# EasyEDA schematic SCH_4Mb OMEGA V2 LEDS copy_2023-09-07.json
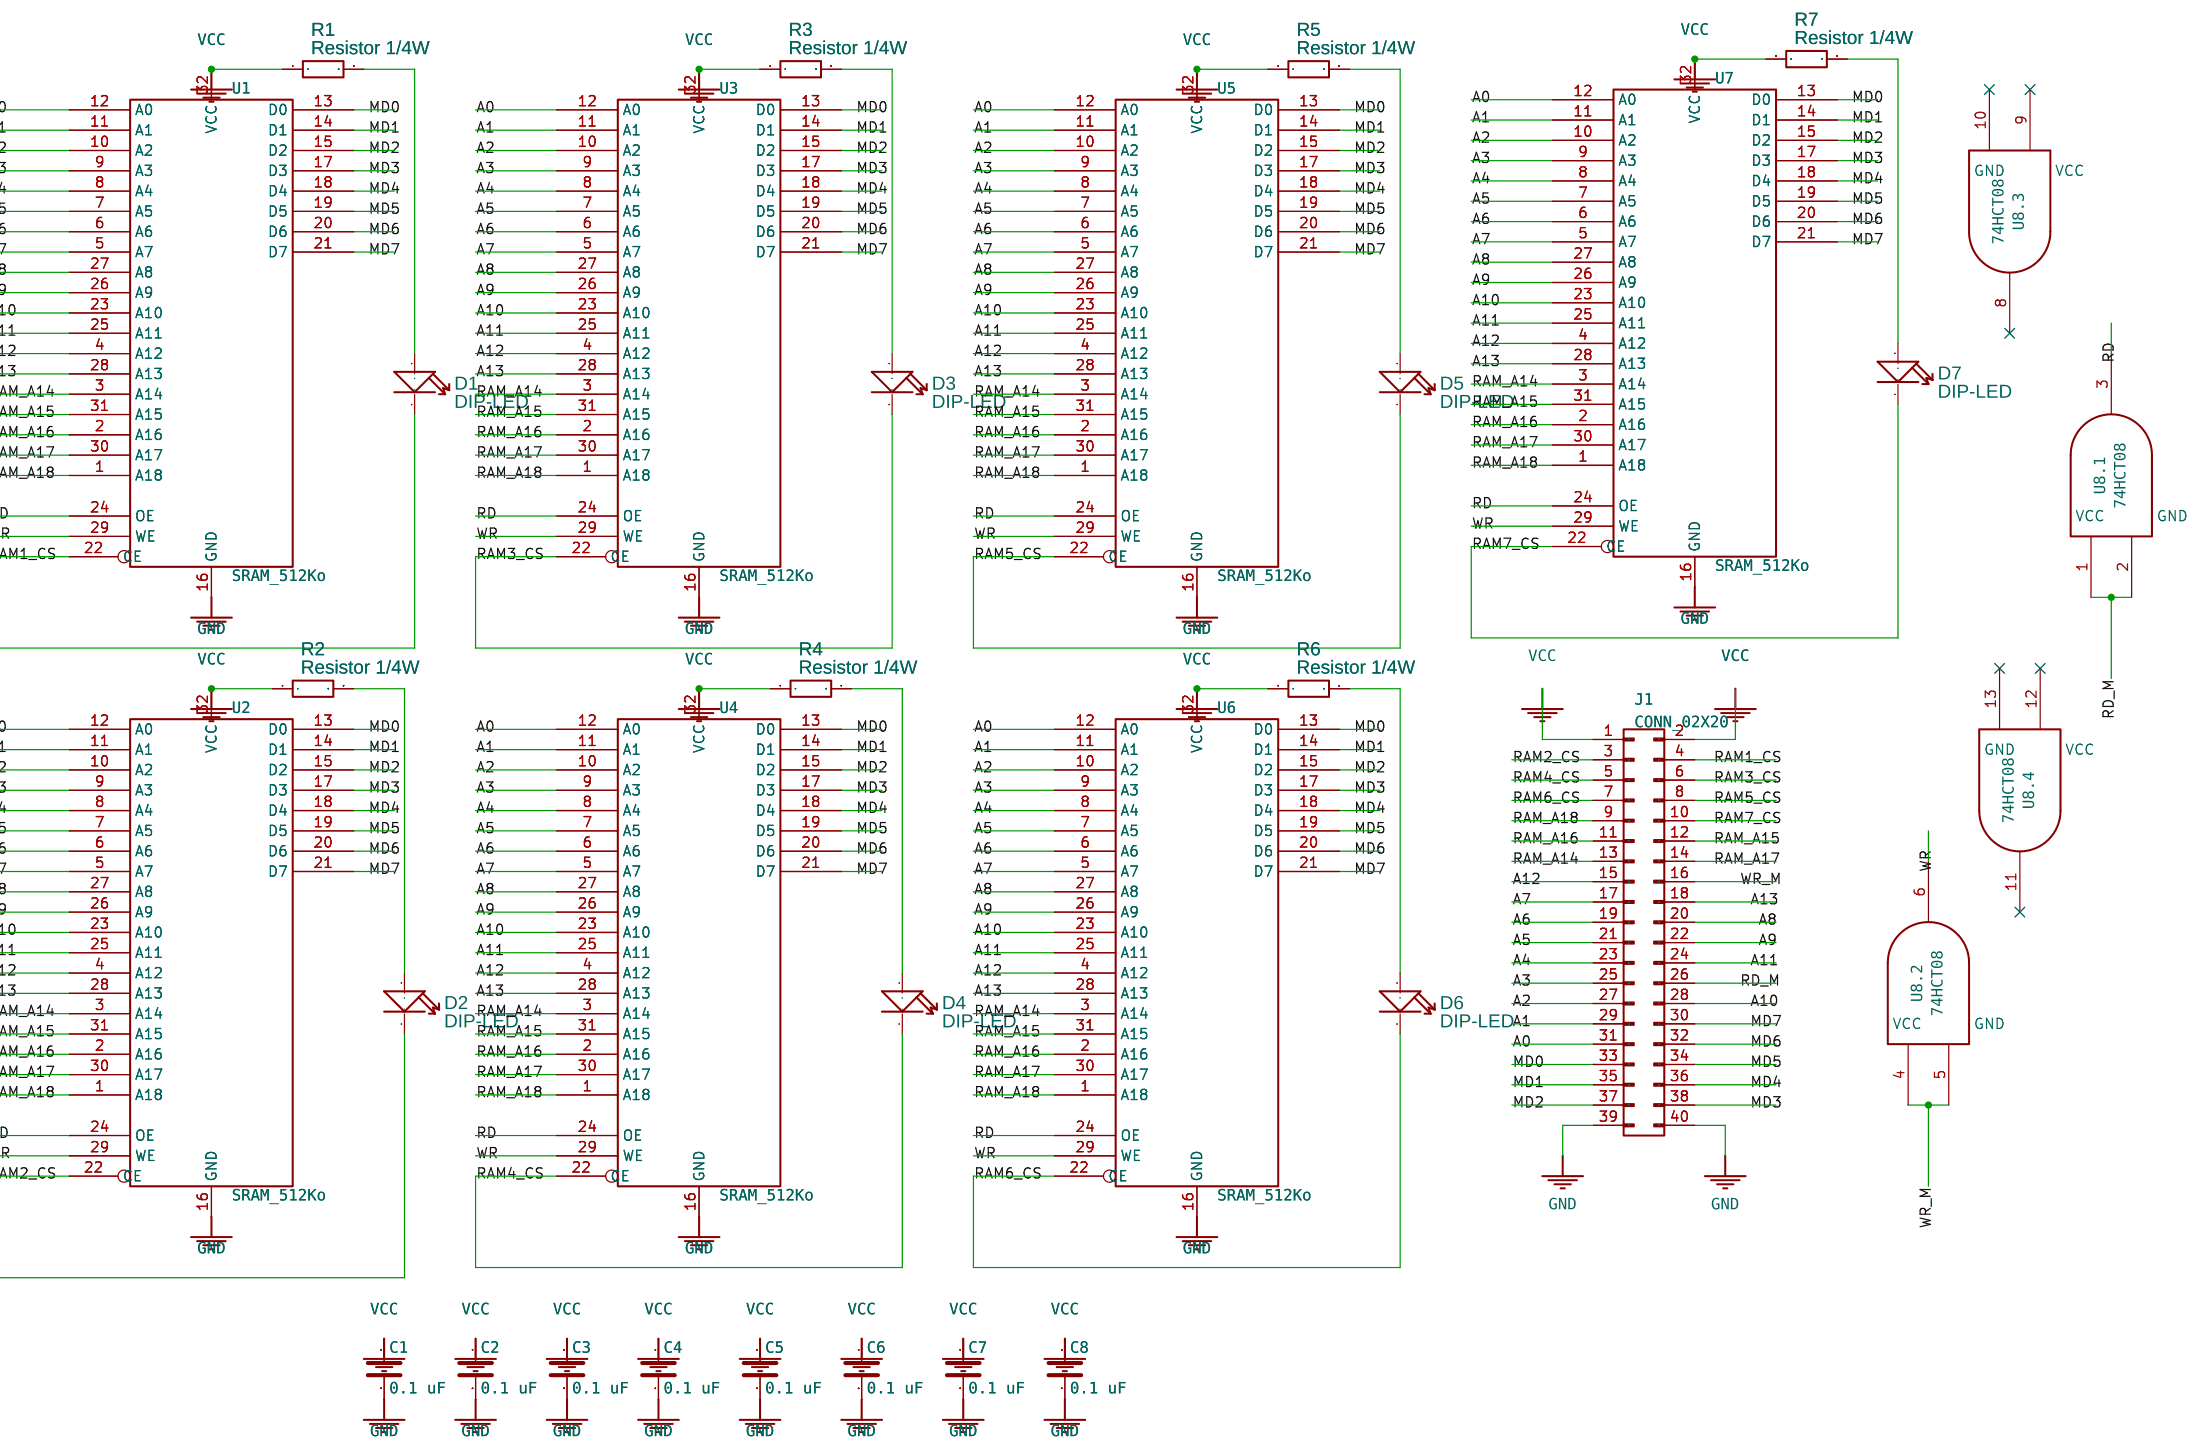
[diagram p0: schematic sheet]

## Parts
C1  0.1 uF  [C_DISC_D7.5MM_W2.5MM_P5.00MM]
C2  0.1 uF  [C_DISC_D7.5MM_W2.5MM_P5.00MM]
C3  0.1 uF  [C_DISC_D7.5MM_W2.5MM_P5.00MM]
C4  0.1 uF  [C_DISC_D7.5MM_W2.5MM_P5.00MM]
C5  0.1 uF  [C_DISC_D7.5MM_W2.5MM_P5.00MM]
C6  0.1 uF  [C_DISC_D7.5MM_W2.5MM_P5.00MM]
C7  0.1 uF  [C_DISC_D7.5MM_W2.5MM_P5.00MM]
C8  0.1 uF  [C_DISC_D7.5MM_W2.5MM_P5.00MM]
D1  DIP-LED  [LED2-2.54-D3.0MM]
D2  DIP-LED  [LED2-2.54-D3.0MM]
D3  DIP-LED  [LED2-2.54-D3.0MM]
D4  DIP-LED  [LED2-2.54-D3.0MM]
D5  DIP-LED  [LED2-2.54-D3.0MM]
D6  DIP-LED  [LED2-2.54-D3.0MM]
D7  DIP-LED  [LED2-2.54-D3.0MM]
J1  CONN_02X20  [SOCKET_STRIP_STRAIGHT_2X20_PITCH2.54MM]
R1  Resistor 1/4W  [RESISTOR 1/4W]
R2  Resistor 1/4W  [RESISTOR 1/4W]
R3  Resistor 1/4W  [RESISTOR 1/4W]
R4  Resistor 1/4W  [RESISTOR 1/4W]
R5  Resistor 1/4W  [RESISTOR 1/4W]
R6  Resistor 1/4W  [RESISTOR 1/4W]
R7  Resistor 1/4W  [RESISTOR 1/4W]
U1  SRAM_512Ko  [DIP-32_W15.24MM_LONGPADS_ORIFICIO_0_95]
U2  SRAM_512Ko  [DIP-32_W15.24MM_LONGPADS_ORIFICIO_0_95]
U3  SRAM_512Ko  [DIP-32_W15.24MM_LONGPADS_ORIFICIO_0_95]
U4  SRAM_512Ko  [DIP-32_W15.24MM_LONGPADS_ORIFICIO_0_95]
U5  SRAM_512Ko  [DIP-32_W15.24MM_LONGPADS_ORIFICIO_0_95]
U6  SRAM_512Ko  [DIP-32_W15.24MM_LONGPADS_ORIFICIO_0_95]
U7  SRAM_512Ko  [DIP-32_W15.24MM_LONGPADS_ORIFICIO_0_95]
U8  74HCT08  [DIP-14_ORIFICIO_0_95]  (sections 1,2,3,4)

## Library data of the parts
D1-D7 = DIP-LED-GREEN-GREEN(2P-D3MM): Contributor: Mudassir_Ahmed_Khan
R1-R7 = Resistor 1/4W: Power: 1/4W; Tolerance: ±1%; Supplier Part: C57435; Supplier: LCSC; Manufacturer: UniOhm; Manufacturer Part: MFR0W4F1001A50; Contributor: hafiz_8030

## Nets
GND: C1.2 C2.2 C3.2 C4.2 C5.2 C6.2 C7.2 C8.2 J1.39(P39) J1.40(P40) U1.16(GND) U2.16(GND) U3.16(GND) U4.16(GND) U5.16(GND) U6.16(GND) U7.16(GND)
VCC: C1.1 C2.1 C3.1 C4.1 C5.1 C6.1 C7.1 C8.1 J1.1(P1) J1.2(P2) R1.1 R2.1 R3.1 R4.1 R5.1 R6.1 R7.1 U1.32(VCC) U2.32(VCC) U3.32(VCC) U4.32(VCC) U5.32(VCC) U6.32(VCC) U7.32(VCC)
A0: J1.31(P31) U1.12(A0) U2.12(A0) U3.12(A0) U4.12(A0) U5.12(A0) U6.12(A0) U7.12(A0)
A1: J1.29(P29) U1.11(A1) U2.11(A1) U3.11(A1) U4.11(A1) U5.11(A1) U6.11(A1) U7.11(A1)
A2: J1.27(P27) U1.10(A2) U2.10(A2) U3.10(A2) U4.10(A2) U5.10(A2) U6.10(A2) U7.10(A2)
A3: J1.25(P25) U1.9(A3) U2.9(A3) U3.9(A3) U4.9(A3) U5.9(A3) U6.9(A3) U7.9(A3)
A4: J1.23(P23) U1.8(A4) U2.8(A4) U3.8(A4) U4.8(A4) U5.8(A4) U6.8(A4) U7.8(A4)
A5: J1.21(P21) U1.7(A5) U2.7(A5) U3.7(A5) U4.7(A5) U5.7(A5) U6.7(A5) U7.7(A5)
A6: J1.19(P19) U1.6(A6) U2.6(A6) U3.6(A6) U4.6(A6) U5.6(A6) U6.6(A6) U7.6(A6)
A7: J1.17(P17) U1.5(A7) U2.5(A7) U3.5(A7) U4.5(A7) U5.5(A7) U6.5(A7) U7.5(A7)
A8: J1.20(P20) U1.27(A8) U2.27(A8) U3.27(A8) U4.27(A8) U5.27(A8) U6.27(A8) U7.27(A8)
A9: J1.22(P22) U1.26(A9) U2.26(A9) U3.26(A9) U4.26(A9) U5.26(A9) U6.26(A9) U7.26(A9)
A10: J1.28(P28) U1.23(A10) U2.23(A10) U3.23(A10) U4.23(A10) U5.23(A10) U6.23(A10) U7.23(A10)
A11: J1.24(P24) U1.25(A11) U2.25(A11) U3.25(A11) U4.25(A11) U5.25(A11) U6.25(A11) U7.25(A11)
A12: J1.15(P15) U1.4(A12) U2.4(A12) U3.4(A12) U4.4(A12) U5.4(A12) U6.4(A12) U7.4(A12)
A13: J1.18(P18) U1.28(A13) U2.28(A13) U3.28(A13) U4.28(A13) U5.28(A13) U6.28(A13) U7.28(A13)
MD0: J1.33(P33) U1.13(D0) U2.13(D0) U3.13(D0) U4.13(D0) U5.13(D0) U6.13(D0) U7.13(D0)
MD1: J1.35(P35) U1.14(D1) U2.14(D1) U3.14(D1) U4.14(D1) U5.14(D1) U6.14(D1) U7.14(D1)
MD2: J1.37(P37) U1.15(D2) U2.15(D2) U3.15(D2) U4.15(D2) U5.15(D2) U6.15(D2) U7.15(D2)
MD3: J1.38(P38) U1.17(D3) U2.17(D3) U3.17(D3) U4.17(D3) U5.17(D3) U6.17(D3) U7.17(D3)
MD4: J1.36(P36) U1.18(D4) U2.18(D4) U3.18(D4) U4.18(D4) U5.18(D4) U6.18(D4) U7.18(D4)
MD5: J1.34(P34) U1.19(D5) U2.19(D5) U3.19(D5) U4.19(D5) U5.19(D5) U6.19(D5) U7.19(D5)
MD6: J1.32(P32) U1.20(D6) U2.20(D6) U3.20(D6) U4.20(D6) U5.20(D6) U6.20(D6) U7.20(D6)
MD7: J1.30(P30) U1.21(D7) U2.21(D7) U3.21(D7) U4.21(D7) U5.21(D7) U6.21(D7) U7.21(D7)
RAM1_CS: D1.K(-) J1.4(P4) U1.22(CE)
RAM2_CS: D2.K(-) J1.3(P3) U2.22(CE)
RAM3_CS: D3.K(-) J1.6(P6) U3.22(CE)
RAM4_CS: D4.K(-) J1.5(P5) U4.22(CE)
RAM5_CS: D5.K(-) J1.8(P8) U5.22(CE)
RAM6_CS: D6.K(-) J1.7(P7) U6.22(CE)
RAM7_CS: D7.K(-) J1.10(P10) U7.22(CE)
RAM_A14: J1.13(P13) U1.3(A14) U2.3(A14) U3.3(A14) U4.3(A14) U5.3(A14) U6.3(A14) U7.3(A14)
RAM_A15: J1.12(P12) U1.31(A15) U2.31(A15) U3.31(A15) U4.31(A15) U5.31(A15) U6.31(A15) U7.31(A15)
RAM_A16: J1.11(P11) U1.2(A16) U2.2(A16) U3.2(A16) U4.2(A16) U5.2(A16) U6.2(A16) U7.2(A16)
RAM_A17: J1.14(P14) U1.30(A17) U2.30(A17) U3.30(A17) U4.30(A17) U5.30(A17) U6.30(A17) U7.30(A17)
RAM_A18: J1.9(P9) U1.1(A18) U2.1(A18) U3.1(A18) U4.1(A18) U5.1(A18) U6.1(A18) U7.1(A18)
RD: U1.24(OE) U2.24(OE) U3.24(OE) U4.24(OE) U5.24(OE) U6.24(OE) U7.24(OE) U8.3
RD_M: J1.26(P26) U8.1 U8.2
WR: U1.29(WE) U2.29(WE) U3.29(WE) U4.29(WE) U5.29(WE) U6.29(WE) U7.29(WE) U8.6
WR_M: J1.16(P16) U8.4 U8.5
Net-(D1-A): D1.A(+) R1.2
Net-(D2-A): D2.A(+) R2.2
Net-(D3-A): D3.A(+) R3.2
Net-(D4-A): D4.A(+) R4.2
Net-(D5-A): D5.A(+) R5.2
Net-(D6-A): D6.A(+) R6.2
Net-(D7-A): D7.A(+) R7.2

Not connected (* = marked no-connect by the designer): U8 7(GND) 8* 9* 10* 11* 12* 13* 14(VCC)
